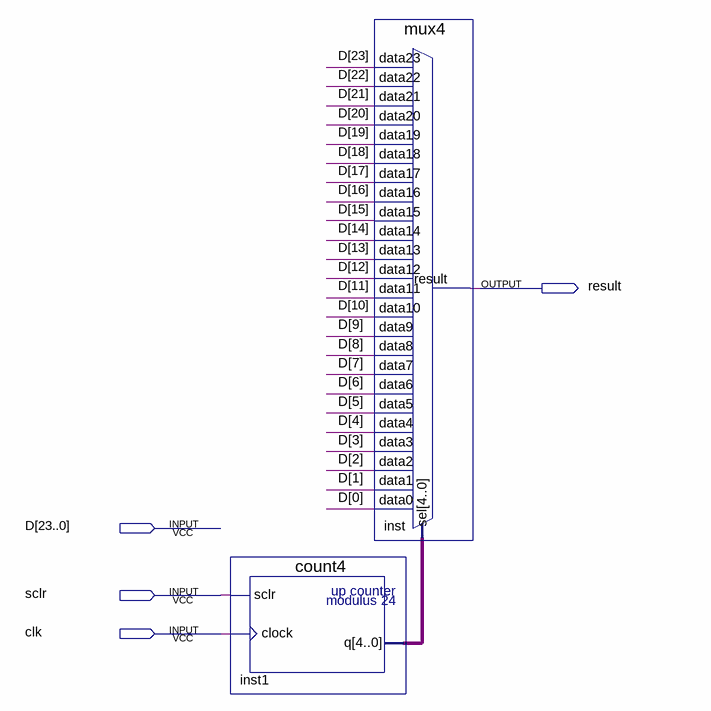
[diagram p0: schematic sheet]
// Quartus schematic b4.bdf as structural Verilog: 2 symbols, 4 pins
module b4 (
  input  [23:0] D,
  input  sclr,
  input  clk,
  output result
);

  wire [4:0] inst1_q;

  count4 inst1 (.sclr(sclr), .clock(clk), .q(inst1_q));
  mux4 inst (
    .data23(D[23]), .data22(D[22]), .data21(D[21]), .data20(D[20]), .data19(D[19]), .data18(D[18]),
    .data17(D[17]), .data16(D[16]), .data15(D[15]), .data14(D[14]), .data13(D[13]), .data12(D[12]),
    .data11(D[11]), .data10(D[10]), .data9(D[9]), .data8(D[8]), .data7(D[7]), .data6(D[6]), .data5(D[5]),
    .data4(D[4]), .data3(D[3]), .data2(D[2]), .data1(D[1]), .data0(D[0]), .sel(inst1_q), .result(result));
endmodule
